# Altium schematic sheet Top.SchDoc: Top schematic
size A3; DocumentNumber: MB1144; Revision: C-02; SheetNumber: 1; SheetTotal: 25; PageSetup: Record=PageOptions|CenterHorizontal=True|CenterVertical=True|PrintScale=1.01|XCorrection=1.00|YCorrection=1.00|PrintKind=1|BorderSize=5000000|LeftOffset=0|BottomOffset=0|Orientation=2|PaperLength=1000|PaperWidth=1000|Scale=100|PaperSource=264|PrintQuality=600|MediaType=1|DitherType=10|PaperKind=A3|PrintScaleMode=1; Project: STM32L476G-EVAL; DocumentName: STM32L476G-EVAL; ModifiedDate: 9/23/2015; ProjectName: STM32L476G-EVAL
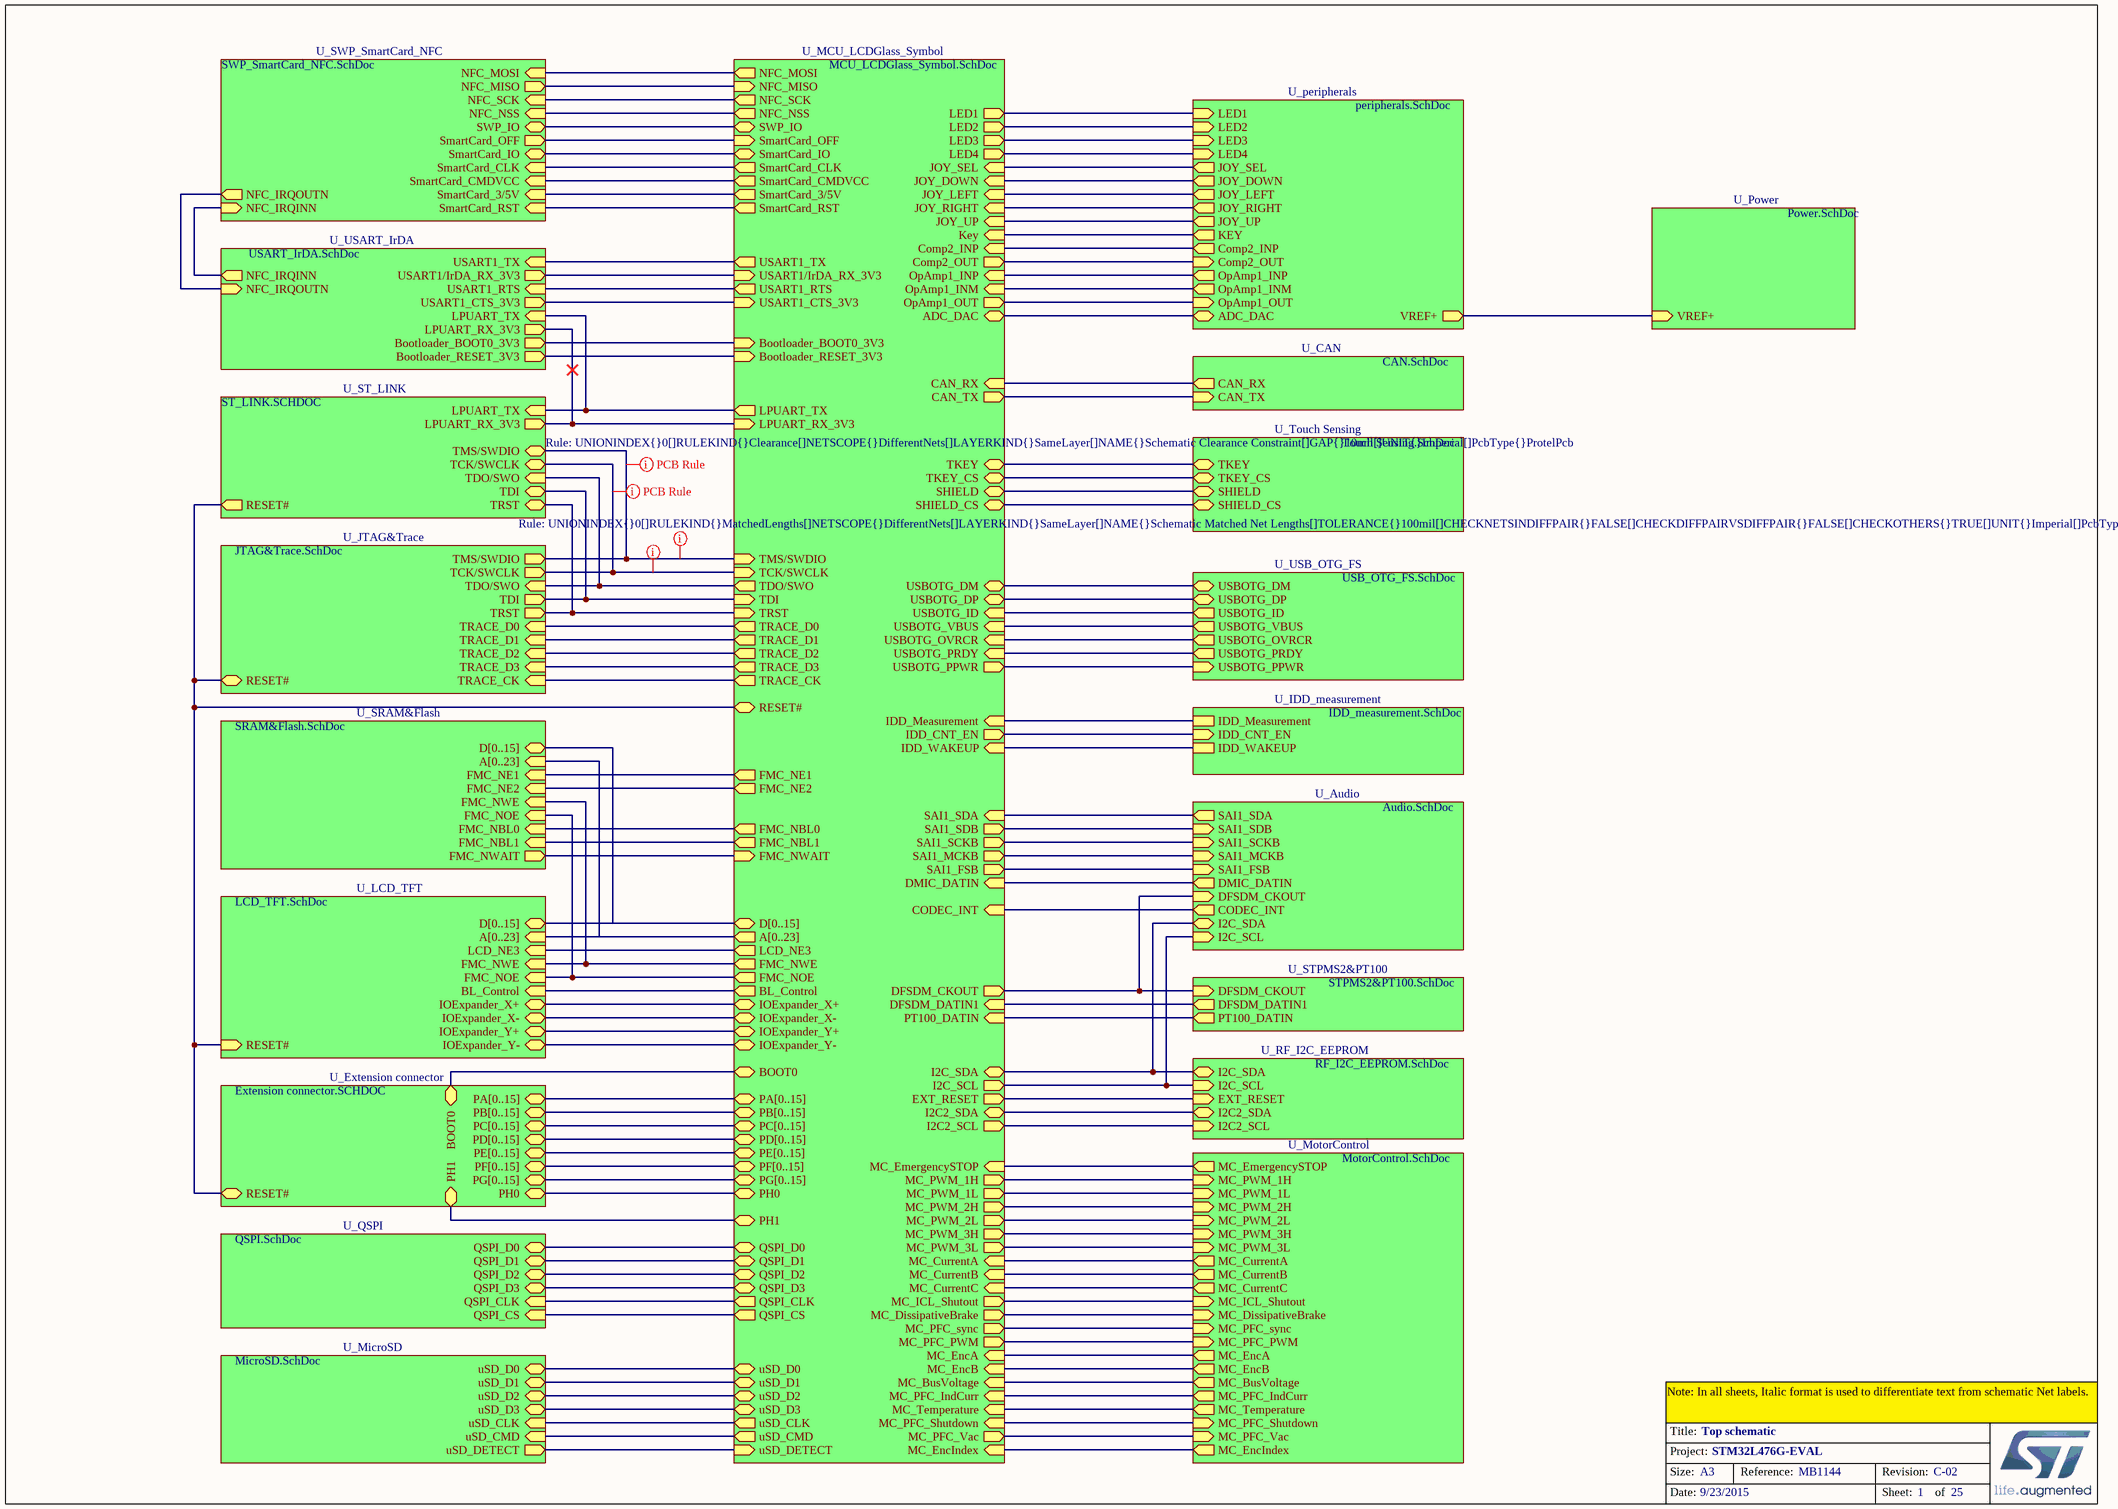
[diagram p0: Top.SchDoc]

## Sub-sheets
U_Audio = Audio.SchDoc: SAI1_SCKB (in), SAI1_FSB (in), SAI1_SDB (in), CODEC_INT (out), I2C_SCL (in), SAI1_MCKB (in), I2C_SDA (bidir), DMIC_DATIN (out), DFSDM_CKOUT (in), SAI1_SDA (out)
U_CAN = CAN.SchDoc: CAN_TX (in), CAN_RX (out)
U_Extension connector = Extension connector.SCHDOC: PA[0..15] (bidir), PB[0..15] (bidir), PC[0..15] (bidir), PD[0..15] (bidir), PE[0..15] (bidir), RESET# (bidir), PF[0..15] (bidir), PG[0..15] (bidir), PH1, PH0, BOOT0
U_IDD_measurement = IDD_measurement.SchDoc: IDD_Measurement, IDD_CNT_EN (in), IDD_WAKEUP
U_JTAG&Trace = JTAG&Trace.SchDoc: TDI (out), RESET# (bidir), TRACE_D3 (in), TRACE_D2 (in), TRACE_D1 (in), TRACE_D0 (in), TRACE_CK (in), TRST (out), TMS/SWDIO (out), TCK/SWCLK (out), TDO/SWO (in)
U_LCD_TFT = LCD_TFT.SchDoc: RESET# (in), FMC_NWE (in), LCD_NE3 (in), FMC_NOE (in), D[0..15] (bidir), A[0..23] (in), IOExpander_Y+ (bidir), IOExpander_Y- (bidir), IOExpander_X+ (bidir), IOExpander_X- (bidir), BL_Control (in)
U_MCU_LCDGlass_Symbol = MCU_LCDGlass_Symbol.SchDoc: FMC_NWAIT (in), FMC_NOE (out), FMC_NWE (out), FMC_NE1 (out), FMC_NE2 (out), LCD_NE3 (out), LED1 (out), LED2 (out), LPUART_TX (out), USART1_TX (out), USART1_RTS (out), TMS/SWDIO (in), TCK/SWCLK (in), TDI (in), TRST (in), Key (in), DFSDM_DATIN1 (in), IDD_Measurement (in), CODEC_INT (in), USBOTG_PRDY (in), USBOTG_OVRCR (in), DMIC_DATIN (in), PT100_DATIN (in), USBOTG_VBUS (in), USBOTG_ID (in), IDD_WAKEUP (in), OpAmp1_INM (in), Comp2_INP (in), TDO/SWO (out), TRACE_D1 (out), TRACE_D2 (out), TRACE_D3 (out), IDD_CNT_EN (out), USBOTG_PPWR (out), TRACE_CK (out), TRACE_D0 (out), SmartCard_CLK (out), OpAmp1_OUT (out), ADC_DAC (bidir), USBOTG_DP (bidir), USBOTG_DM (bidir), SmartCard_IO (bidir), QSPI_D0 (bidir), QSPI_D1 (bidir), QSPI_D2 (bidir), QSPI_D3 (bidir), uSD_D0 (bidir), uSD_D1 (bidir), uSD_D2 (bidir), uSD_D3 (bidir), MC_DissipativeBrake (out), MC_PFC_sync (out), MC_PWM_1H (out), MC_PWM_1L (out), MC_PWM_2H (out), MC_PWM_2L (out), MC_PWM_3H (out), MC_PWM_3L (out), MC_ICL_Shutout (out), MC_PFC_PWM (out), MC_PFC_Vac (out), QSPI_CLK (out), QSPI_CS (out), FMC_NBL0 (out), FMC_NBL1 (out), CAN_TX (out), MC_EncA (in), MC_EncB (in), MC_EncIndex (in), MC_CurrentB (in), MC_CurrentC (in), MC_Temperature (in), MC_PFC_Shutdown (in), CAN_RX (in), uSD_DETECT (in), uSD_CMD (out), uSD_CLK (out), SWP_IO (bidir), IOExpander_X+ (bidir), IOExpander_X- (bidir), IOExpander_Y+ (bidir), IOExpander_Y- (bidir), JOY_SEL (in), JOY_DOWN (in), JOY_LEFT (in), JOY_RIGHT (in), JOY_UP (in), SmartCard_OFF (in), LED4 (out), LED3 (out), SmartCard_RST (out), SmartCard_CMDVCC (out), SmartCard_3/5V (out), D[0..15] (bidir), A[0..23] (out), PA[0..15] (bidir), PB[0..15] (bidir), PC[0..15] (bidir), PD[0..15] (bidir), PE[0..15] (bidir), PF[0..15] (bidir), PG[0..15] (bidir), MC_CurrentA (in), MC_EmergencySTOP (in), MC_BusVoltage (in), MC_PFC_IndCurr (in), RESET# (bidir), DFSDM_CKOUT (out), I2C_SCL (out), I2C_SDA (bidir), PH1, PH0, SHIELD, SAI1_MCKB (out), SAI1_SCKB (out), SAI1_FSB (out), SAI1_SDB (out), SAI1_SDA (in), OpAmp1_INP (in), Comp2_OUT (out), TKEY, TKEY_CS, SHIELD_CS, Bootloader_RESET_3V3 (in), Bootloader_BOOT0_3V3 (in), LPUART_RX_3V3 (in), USART1_CTS_3V3 (in), USART1/IrDA_RX_3V3 (in), BL_Control (out), EXT_RESET (out), BOOT0, NFC_NSS (out), NFC_MOSI (out), NFC_SCK (out), NFC_MISO (in), I2C2_SDA (bidir), I2C2_SCL (out)
U_MicroSD = MicroSD.SchDoc: uSD_CLK (in), uSD_CMD (in), uSD_D0 (bidir), uSD_D1 (bidir), uSD_D2 (bidir), uSD_D3 (bidir), uSD_DETECT (out)
U_MotorControl = MotorControl.SchDoc: MC_EmergencySTOP (out), MC_CurrentA (out), MC_CurrentB (out), MC_CurrentC (out), MC_PFC_sync (in), MC_PWM_3L (in), MC_PWM_2H (in), MC_PWM_2L (in), MC_PWM_1H (in), MC_PWM_1L (in), MC_PWM_3H (in), MC_ICL_Shutout (in), MC_DissipativeBrake (in), MC_PFC_PWM (in), MC_EncA (out), MC_EncB (out), MC_BusVoltage (out), MC_EncIndex (out), MC_PFC_IndCurr (out), MC_Temperature (out), MC_PFC_Shutdown (in), MC_PFC_Vac (in)
U_peripherals = peripherals.SchDoc: ADC_DAC (bidir), LED4 (in), LED3 (in), LED1 (in), LED2 (in), JOY_SEL (out), JOY_DOWN (out), JOY_LEFT (out), JOY_RIGHT (out), JOY_UP (out), KEY (out), VREF+ (out), Comp2_INP (out), OpAmp1_OUT (in), OpAmp1_INM (out), OpAmp1_INP (out), Comp2_OUT (in)
U_Power = Power.SchDoc: VREF+ (in)
U_QSPI = QSPI.SchDoc: QSPI_D0 (bidir), QSPI_D3 (bidir), QSPI_D2 (bidir), QSPI_D1 (bidir), QSPI_CLK (in), QSPI_CS (in)
U_RF_I2C_EEPROM = RF_I2C_EEPROM.SchDoc: I2C_SCL (in), I2C_SDA (bidir), EXT_RESET (in), I2C2_SDA (bidir), I2C2_SCL (in)
U_SRAM&Flash = SRAM&Flash.SchDoc: FMC_NWE (in), FMC_NOE (in), FMC_NWAIT (out), FMC_NBL0 (in), FMC_NBL1 (in), D[0..15] (bidir), A[0..23] (in), FMC_NE1 (in), FMC_NE2 (in)
U_ST_LINK = ST_LINK.SCHDOC: TDO/SWO (in), RESET# (out), TDI, TRST, TMS/SWDIO, TCK/SWCLK, LPUART_RX_3V3 (out), LPUART_TX (in)
U_STPMS2&PT100 = STPMS2&PT100.SchDoc: DFSDM_CKOUT (in), DFSDM_DATIN1 (out), PT100_DATIN (out)
U_SWP_SmartCard_NFC = SWP_SmartCard_NFC.SchDoc: SWP_IO (bidir), SmartCard_3/5V (in), SmartCard_IO (bidir), SmartCard_RST (in), SmartCard_CLK (in), SmartCard_OFF (out), SmartCard_CMDVCC (in), NFC_IRQINN (in), NFC_IRQOUTN (out), NFC_NSS (in), NFC_MOSI (in), NFC_MISO (out), NFC_SCK (in)
U_Touch Sensing = Touch Sensing.SchDoc: SHIELD, SHIELD_CS, TKEY_CS, TKEY
U_USART_IrDA = USART_IrDA.SchDoc: USART1/IrDA_RX_3V3 (out), Bootloader_BOOT0_3V3 (out), Bootloader_RESET_3V3 (out), USART1_CTS_3V3 (out), USART1_TX (in), USART1_RTS (in), LPUART_RX_3V3 (out), LPUART_TX (in), NFC_IRQINN (out), NFC_IRQOUTN (in)
U_USB_OTG_FS = USB_OTG_FS.SchDoc: USBOTG_VBUS (out), USBOTG_PRDY (out), USBOTG_DM (bidir), USBOTG_DP (bidir), USBOTG_OVRCR (out), USBOTG_PPWR (in), USBOTG_ID (out)

## Nets
(unnamed): sheet U_MCU_LCDGlass_Symbol/FMC_NWAIT, sheet U_SRAM&Flash/FMC_NWAIT
(unnamed): sheet U_MCU_LCDGlass_Symbol/FMC_NOE, sheet U_SRAM&Flash/FMC_NOE, sheet U_LCD_TFT/FMC_NOE
(unnamed): sheet U_MCU_LCDGlass_Symbol/FMC_NWE, sheet U_SRAM&Flash/FMC_NWE, sheet U_LCD_TFT/FMC_NWE
(unnamed): sheet U_MCU_LCDGlass_Symbol/FMC_NE1, sheet U_SRAM&Flash/FMC_NE1
(unnamed): sheet U_MCU_LCDGlass_Symbol/FMC_NE2, sheet U_SRAM&Flash/FMC_NE2
(unnamed): sheet U_MCU_LCDGlass_Symbol/LCD_NE3, sheet U_LCD_TFT/LCD_NE3
(unnamed): sheet U_MCU_LCDGlass_Symbol/LED1, sheet U_peripherals/LED1
(unnamed): sheet U_MCU_LCDGlass_Symbol/LED2, sheet U_peripherals/LED2
(unnamed): sheet U_MCU_LCDGlass_Symbol/LPUART_TX, sheet U_ST_LINK/LPUART_TX, sheet U_USART_IrDA/LPUART_TX
(unnamed): sheet U_MCU_LCDGlass_Symbol/USART1_TX, sheet U_USART_IrDA/USART1_TX
(unnamed): sheet U_MCU_LCDGlass_Symbol/USART1_RTS, sheet U_USART_IrDA/USART1_RTS
(unnamed): sheet U_MCU_LCDGlass_Symbol/TMS/SWDIO, sheet U_JTAG&Trace/TMS/SWDIO, sheet U_ST_LINK/TMS/SWDIO
(unnamed): sheet U_MCU_LCDGlass_Symbol/TCK/SWCLK, sheet U_JTAG&Trace/TCK/SWCLK, sheet U_ST_LINK/TCK/SWCLK
(unnamed): sheet U_MCU_LCDGlass_Symbol/TDI, sheet U_JTAG&Trace/TDI, sheet U_ST_LINK/TDI
(unnamed): sheet U_MCU_LCDGlass_Symbol/TRST, sheet U_JTAG&Trace/TRST, sheet U_ST_LINK/TRST
(unnamed): sheet U_MCU_LCDGlass_Symbol/Key, sheet U_peripherals/KEY
(unnamed): sheet U_MCU_LCDGlass_Symbol/DFSDM_DATIN1, sheet U_STPMS2&PT100/DFSDM_DATIN1
(unnamed): sheet U_MCU_LCDGlass_Symbol/IDD_Measurement, sheet U_IDD_measurement/IDD_Measurement
(unnamed): sheet U_MCU_LCDGlass_Symbol/CODEC_INT, sheet U_Audio/CODEC_INT
(unnamed): sheet U_MCU_LCDGlass_Symbol/USBOTG_PRDY, sheet U_USB_OTG_FS/USBOTG_PRDY
(unnamed): sheet U_MCU_LCDGlass_Symbol/USBOTG_OVRCR, sheet U_USB_OTG_FS/USBOTG_OVRCR
(unnamed): sheet U_MCU_LCDGlass_Symbol/DMIC_DATIN, sheet U_Audio/DMIC_DATIN
(unnamed): sheet U_MCU_LCDGlass_Symbol/PT100_DATIN, sheet U_STPMS2&PT100/PT100_DATIN
(unnamed): sheet U_MCU_LCDGlass_Symbol/USBOTG_VBUS, sheet U_USB_OTG_FS/USBOTG_VBUS
(unnamed): sheet U_MCU_LCDGlass_Symbol/USBOTG_ID, sheet U_USB_OTG_FS/USBOTG_ID
(unnamed): sheet U_MCU_LCDGlass_Symbol/IDD_WAKEUP, sheet U_IDD_measurement/IDD_WAKEUP
(unnamed): sheet U_MCU_LCDGlass_Symbol/OpAmp1_INM, sheet U_peripherals/OpAmp1_INM
(unnamed): sheet U_MCU_LCDGlass_Symbol/Comp2_INP, sheet U_peripherals/Comp2_INP
(unnamed): sheet U_MCU_LCDGlass_Symbol/TDO/SWO, sheet U_JTAG&Trace/TDO/SWO, sheet U_ST_LINK/TDO/SWO
(unnamed): sheet U_MCU_LCDGlass_Symbol/TRACE_D1, sheet U_JTAG&Trace/TRACE_D1
(unnamed): sheet U_MCU_LCDGlass_Symbol/TRACE_D2, sheet U_JTAG&Trace/TRACE_D2
(unnamed): sheet U_MCU_LCDGlass_Symbol/TRACE_D3, sheet U_JTAG&Trace/TRACE_D3
(unnamed): sheet U_MCU_LCDGlass_Symbol/IDD_CNT_EN, sheet U_IDD_measurement/IDD_CNT_EN
(unnamed): sheet U_MCU_LCDGlass_Symbol/USBOTG_PPWR, sheet U_USB_OTG_FS/USBOTG_PPWR
(unnamed): sheet U_MCU_LCDGlass_Symbol/TRACE_CK, sheet U_JTAG&Trace/TRACE_CK
(unnamed): sheet U_MCU_LCDGlass_Symbol/TRACE_D0, sheet U_JTAG&Trace/TRACE_D0
(unnamed): sheet U_MCU_LCDGlass_Symbol/SmartCard_CLK, sheet U_SWP_SmartCard_NFC/SmartCard_CLK
(unnamed): sheet U_MCU_LCDGlass_Symbol/OpAmp1_OUT, sheet U_peripherals/OpAmp1_OUT
(unnamed): sheet U_MCU_LCDGlass_Symbol/ADC_DAC, sheet U_peripherals/ADC_DAC
(unnamed): sheet U_MCU_LCDGlass_Symbol/USBOTG_DP, sheet U_USB_OTG_FS/USBOTG_DP
(unnamed): sheet U_MCU_LCDGlass_Symbol/USBOTG_DM, sheet U_USB_OTG_FS/USBOTG_DM
(unnamed): sheet U_MCU_LCDGlass_Symbol/SmartCard_IO, sheet U_SWP_SmartCard_NFC/SmartCard_IO
(unnamed): sheet U_MCU_LCDGlass_Symbol/QSPI_D0, sheet U_QSPI/QSPI_D0
(unnamed): sheet U_MCU_LCDGlass_Symbol/QSPI_D1, sheet U_QSPI/QSPI_D1
(unnamed): sheet U_MCU_LCDGlass_Symbol/QSPI_D2, sheet U_QSPI/QSPI_D2
(unnamed): sheet U_MCU_LCDGlass_Symbol/QSPI_D3, sheet U_QSPI/QSPI_D3
(unnamed): sheet U_MCU_LCDGlass_Symbol/uSD_D0, sheet U_MicroSD/uSD_D0
(unnamed): sheet U_MCU_LCDGlass_Symbol/uSD_D1, sheet U_MicroSD/uSD_D1
(unnamed): sheet U_MCU_LCDGlass_Symbol/uSD_D2, sheet U_MicroSD/uSD_D2
(unnamed): sheet U_MCU_LCDGlass_Symbol/uSD_D3, sheet U_MicroSD/uSD_D3
(unnamed): sheet U_MCU_LCDGlass_Symbol/MC_DissipativeBrake, sheet U_MotorControl/MC_DissipativeBrake
(unnamed): sheet U_MCU_LCDGlass_Symbol/MC_PFC_sync, sheet U_MotorControl/MC_PFC_sync
(unnamed): sheet U_MCU_LCDGlass_Symbol/MC_PWM_1H, sheet U_MotorControl/MC_PWM_1H
(unnamed): sheet U_MCU_LCDGlass_Symbol/MC_PWM_1L, sheet U_MotorControl/MC_PWM_1L
(unnamed): sheet U_MCU_LCDGlass_Symbol/MC_PWM_2H, sheet U_MotorControl/MC_PWM_2H
(unnamed): sheet U_MCU_LCDGlass_Symbol/MC_PWM_2L, sheet U_MotorControl/MC_PWM_2L
(unnamed): sheet U_MCU_LCDGlass_Symbol/MC_PWM_3H, sheet U_MotorControl/MC_PWM_3H
(unnamed): sheet U_MCU_LCDGlass_Symbol/MC_PWM_3L, sheet U_MotorControl/MC_PWM_3L
(unnamed): sheet U_MCU_LCDGlass_Symbol/MC_ICL_Shutout, sheet U_MotorControl/MC_ICL_Shutout
(unnamed): sheet U_MCU_LCDGlass_Symbol/MC_PFC_PWM, sheet U_MotorControl/MC_PFC_PWM
(unnamed): sheet U_MCU_LCDGlass_Symbol/MC_PFC_Vac, sheet U_MotorControl/MC_PFC_Vac
(unnamed): sheet U_MCU_LCDGlass_Symbol/QSPI_CLK, sheet U_QSPI/QSPI_CLK
(unnamed): sheet U_MCU_LCDGlass_Symbol/QSPI_CS, sheet U_QSPI/QSPI_CS
(unnamed): sheet U_MCU_LCDGlass_Symbol/FMC_NBL0, sheet U_SRAM&Flash/FMC_NBL0
(unnamed): sheet U_MCU_LCDGlass_Symbol/FMC_NBL1, sheet U_SRAM&Flash/FMC_NBL1
(unnamed): sheet U_MCU_LCDGlass_Symbol/CAN_TX, sheet U_CAN/CAN_TX
(unnamed): sheet U_MCU_LCDGlass_Symbol/MC_EncA, sheet U_MotorControl/MC_EncA
(unnamed): sheet U_MCU_LCDGlass_Symbol/MC_EncB, sheet U_MotorControl/MC_EncB
(unnamed): sheet U_MCU_LCDGlass_Symbol/MC_EncIndex, sheet U_MotorControl/MC_EncIndex
(unnamed): sheet U_MCU_LCDGlass_Symbol/MC_CurrentB, sheet U_MotorControl/MC_CurrentB
(unnamed): sheet U_MCU_LCDGlass_Symbol/MC_CurrentC, sheet U_MotorControl/MC_CurrentC
(unnamed): sheet U_MCU_LCDGlass_Symbol/MC_Temperature, sheet U_MotorControl/MC_Temperature
(unnamed): sheet U_MCU_LCDGlass_Symbol/MC_PFC_Shutdown, sheet U_MotorControl/MC_PFC_Shutdown
(unnamed): sheet U_MCU_LCDGlass_Symbol/CAN_RX, sheet U_CAN/CAN_RX
(unnamed): sheet U_MCU_LCDGlass_Symbol/uSD_DETECT, sheet U_MicroSD/uSD_DETECT
(unnamed): sheet U_MCU_LCDGlass_Symbol/uSD_CMD, sheet U_MicroSD/uSD_CMD
(unnamed): sheet U_MCU_LCDGlass_Symbol/uSD_CLK, sheet U_MicroSD/uSD_CLK
(unnamed): sheet U_MCU_LCDGlass_Symbol/SWP_IO, sheet U_SWP_SmartCard_NFC/SWP_IO
(unnamed): sheet U_MCU_LCDGlass_Symbol/IOExpander_X+, sheet U_LCD_TFT/IOExpander_X+
(unnamed): sheet U_MCU_LCDGlass_Symbol/IOExpander_X-, sheet U_LCD_TFT/IOExpander_X-
(unnamed): sheet U_MCU_LCDGlass_Symbol/IOExpander_Y+, sheet U_LCD_TFT/IOExpander_Y+
(unnamed): sheet U_MCU_LCDGlass_Symbol/IOExpander_Y-, sheet U_LCD_TFT/IOExpander_Y-
(unnamed): sheet U_MCU_LCDGlass_Symbol/JOY_SEL, sheet U_peripherals/JOY_SEL
(unnamed): sheet U_MCU_LCDGlass_Symbol/JOY_DOWN, sheet U_peripherals/JOY_DOWN
(unnamed): sheet U_MCU_LCDGlass_Symbol/JOY_LEFT, sheet U_peripherals/JOY_LEFT
(unnamed): sheet U_MCU_LCDGlass_Symbol/JOY_RIGHT, sheet U_peripherals/JOY_RIGHT
(unnamed): sheet U_MCU_LCDGlass_Symbol/JOY_UP, sheet U_peripherals/JOY_UP
(unnamed): sheet U_MCU_LCDGlass_Symbol/SmartCard_OFF, sheet U_SWP_SmartCard_NFC/SmartCard_OFF
(unnamed): sheet U_MCU_LCDGlass_Symbol/LED4, sheet U_peripherals/LED4
(unnamed): sheet U_MCU_LCDGlass_Symbol/LED3, sheet U_peripherals/LED3
(unnamed): sheet U_MCU_LCDGlass_Symbol/SmartCard_RST, sheet U_SWP_SmartCard_NFC/SmartCard_RST
(unnamed): sheet U_MCU_LCDGlass_Symbol/SmartCard_CMDVCC, sheet U_SWP_SmartCard_NFC/SmartCard_CMDVCC
(unnamed): sheet U_MCU_LCDGlass_Symbol/SmartCard_3/5V, sheet U_SWP_SmartCard_NFC/SmartCard_3/5V
(unnamed): sheet U_MCU_LCDGlass_Symbol/MC_CurrentA, sheet U_MotorControl/MC_CurrentA
(unnamed): sheet U_MCU_LCDGlass_Symbol/MC_EmergencySTOP, sheet U_MotorControl/MC_EmergencySTOP
(unnamed): sheet U_MCU_LCDGlass_Symbol/MC_BusVoltage, sheet U_MotorControl/MC_BusVoltage
(unnamed): sheet U_MCU_LCDGlass_Symbol/MC_PFC_IndCurr, sheet U_MotorControl/MC_PFC_IndCurr
(unnamed): sheet U_MCU_LCDGlass_Symbol/RESET#, sheet U_Extension connector/RESET#, sheet U_JTAG&Trace/RESET#, sheet U_ST_LINK/RESET#, sheet U_LCD_TFT/RESET#
(unnamed): sheet U_MCU_LCDGlass_Symbol/DFSDM_CKOUT, sheet U_STPMS2&PT100/DFSDM_CKOUT, sheet U_Audio/DFSDM_CKOUT
(unnamed): sheet U_MCU_LCDGlass_Symbol/I2C_SCL, sheet U_Audio/I2C_SCL, sheet U_RF_I2C_EEPROM/I2C_SCL
(unnamed): sheet U_MCU_LCDGlass_Symbol/I2C_SDA, sheet U_Audio/I2C_SDA, sheet U_RF_I2C_EEPROM/I2C_SDA
(unnamed): sheet U_MCU_LCDGlass_Symbol/PH1, sheet U_Extension connector/PH1
(unnamed): sheet U_MCU_LCDGlass_Symbol/PH0, sheet U_Extension connector/PH0
(unnamed): sheet U_MCU_LCDGlass_Symbol/SHIELD, sheet U_Touch Sensing/SHIELD
(unnamed): sheet U_MCU_LCDGlass_Symbol/SAI1_MCKB, sheet U_Audio/SAI1_MCKB
(unnamed): sheet U_MCU_LCDGlass_Symbol/SAI1_SCKB, sheet U_Audio/SAI1_SCKB
(unnamed): sheet U_MCU_LCDGlass_Symbol/SAI1_FSB, sheet U_Audio/SAI1_FSB
(unnamed): sheet U_MCU_LCDGlass_Symbol/SAI1_SDB, sheet U_Audio/SAI1_SDB
(unnamed): sheet U_MCU_LCDGlass_Symbol/SAI1_SDA, sheet U_Audio/SAI1_SDA
(unnamed): sheet U_MCU_LCDGlass_Symbol/OpAmp1_INP, sheet U_peripherals/OpAmp1_INP
(unnamed): sheet U_MCU_LCDGlass_Symbol/Comp2_OUT, sheet U_peripherals/Comp2_OUT
(unnamed): sheet U_MCU_LCDGlass_Symbol/TKEY, sheet U_Touch Sensing/TKEY
(unnamed): sheet U_MCU_LCDGlass_Symbol/TKEY_CS, sheet U_Touch Sensing/TKEY_CS
(unnamed): sheet U_MCU_LCDGlass_Symbol/SHIELD_CS, sheet U_Touch Sensing/SHIELD_CS
(unnamed): sheet U_MCU_LCDGlass_Symbol/Bootloader_RESET_3V3, sheet U_USART_IrDA/Bootloader_RESET_3V3
(unnamed): sheet U_MCU_LCDGlass_Symbol/Bootloader_BOOT0_3V3, sheet U_USART_IrDA/Bootloader_BOOT0_3V3
(unnamed): sheet U_MCU_LCDGlass_Symbol/LPUART_RX_3V3, sheet U_ST_LINK/LPUART_RX_3V3, sheet U_USART_IrDA/LPUART_RX_3V3
(unnamed): sheet U_MCU_LCDGlass_Symbol/USART1_CTS_3V3, sheet U_USART_IrDA/USART1_CTS_3V3
(unnamed): sheet U_MCU_LCDGlass_Symbol/USART1/IrDA_RX_3V3, sheet U_USART_IrDA/USART1/IrDA_RX_3V3
(unnamed): sheet U_MCU_LCDGlass_Symbol/BL_Control, sheet U_LCD_TFT/BL_Control
(unnamed): sheet U_MCU_LCDGlass_Symbol/EXT_RESET, sheet U_RF_I2C_EEPROM/EXT_RESET
(unnamed): sheet U_MCU_LCDGlass_Symbol/BOOT0, sheet U_Extension connector/BOOT0
(unnamed): sheet U_MCU_LCDGlass_Symbol/NFC_NSS, sheet U_SWP_SmartCard_NFC/NFC_NSS
(unnamed): sheet U_MCU_LCDGlass_Symbol/NFC_MOSI, sheet U_SWP_SmartCard_NFC/NFC_MOSI
(unnamed): sheet U_MCU_LCDGlass_Symbol/NFC_SCK, sheet U_SWP_SmartCard_NFC/NFC_SCK
(unnamed): sheet U_MCU_LCDGlass_Symbol/NFC_MISO, sheet U_SWP_SmartCard_NFC/NFC_MISO
(unnamed): sheet U_MCU_LCDGlass_Symbol/I2C2_SDA, sheet U_RF_I2C_EEPROM/I2C2_SDA
(unnamed): sheet U_MCU_LCDGlass_Symbol/I2C2_SCL, sheet U_RF_I2C_EEPROM/I2C2_SCL
(unnamed): sheet U_USART_IrDA/NFC_IRQINN, sheet U_SWP_SmartCard_NFC/NFC_IRQINN
(unnamed): sheet U_USART_IrDA/NFC_IRQOUTN, sheet U_SWP_SmartCard_NFC/NFC_IRQOUTN
(unnamed): sheet U_peripherals/VREF+, sheet U_Power/VREF+

## Buses and harness runs
bus sheet U_Extension connector/PA[0..15] = sheet U_MCU_LCDGlass_Symbol/PA[0..15]
bus sheet U_Extension connector/PB[0..15] = sheet U_MCU_LCDGlass_Symbol/PB[0..15]
bus sheet U_Extension connector/PC[0..15] = sheet U_MCU_LCDGlass_Symbol/PC[0..15]
bus sheet U_Extension connector/PD[0..15] = sheet U_MCU_LCDGlass_Symbol/PD[0..15]
bus sheet U_Extension connector/PE[0..15] = sheet U_MCU_LCDGlass_Symbol/PE[0..15]
bus sheet U_Extension connector/PF[0..15] = sheet U_MCU_LCDGlass_Symbol/PF[0..15]
bus sheet U_Extension connector/PG[0..15] = sheet U_MCU_LCDGlass_Symbol/PG[0..15]
bus sheet U_LCD_TFT/A[0..23] = sheet U_MCU_LCDGlass_Symbol/A[0..23] = sheet U_SRAM&Flash/A[0..23]
bus sheet U_LCD_TFT/D[0..15] = sheet U_MCU_LCDGlass_Symbol/D[0..15] = sheet U_SRAM&Flash/D[0..15]

## Layout directives
rule Matched Net Lengths [Tolerance = 100mil]: (no net found under the mark)
rule Clearance Constraint [Clearance = 10mil]: (no net found under the mark)

## Notes on the sheet
- Note: In all sheets, Italic format is used to differentiate text from schematic Net labels.
- Title:
- Project:
- Size:
- Date:
- A3
- Reference:
- Sheet:
- Revision:
- of